# Altium schematic sheet Lighting.SchDoc: Exterior LED Lighting
size A4; DrawnBy: Samyar Sadat Akhavi; Revision: 1.0; SheetNumber: 11; SheetTotal: 13
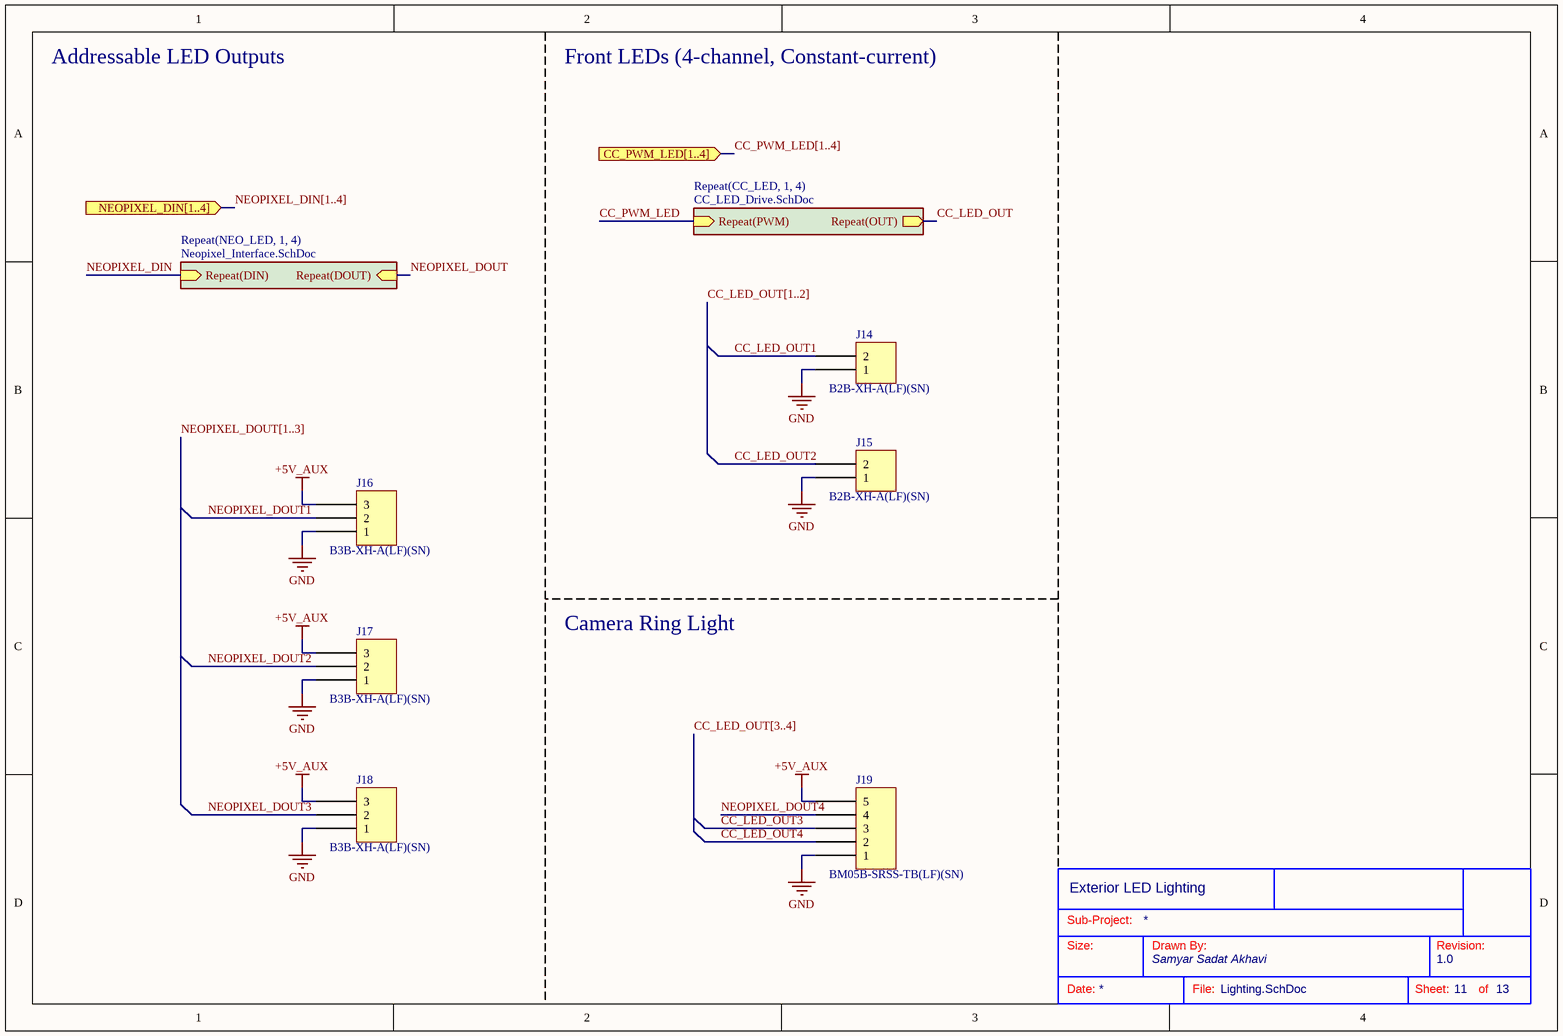
[diagram p0: Lighting.SchDoc]

## Parts
?  (no value)  (graphical)
J14  B2B-XH-A(LF)(SN)  [JST XH B2B-XH-A]
J15  B2B-XH-A(LF)(SN)  [JST XH B2B-XH-A]
J16  B3B-XH-A(LF)(SN)  [JST XH B3B-XH-A]
J17  B3B-XH-A(LF)(SN)  [JST XH B3B-XH-A]
J18  B3B-XH-A(LF)(SN)  [JST XH B3B-XH-A]
J19  BM05B-SRSS-TB(LF)(SN)  [JST BM05B-SRSS-TB]

## Sub-sheets
Repeat(CC_LED, 1, 4) = CC_LED_Drive.SchDoc: Repeat(PWM) (in), Repeat(OUT) (out)
Repeat(NEO_LED, 1, 4) = Neopixel_Interface.SchDoc: Repeat(DIN) (in), Repeat(DOUT) (in)

## Ports
CC_PWM_LED[1..4] (in, see Sensors_IO_Board[3B], Microcontroller[3C]), NEOPIXEL_DIN[1..4] (in, see Sensors_IO_Board[3B])

## Nets
+5V_AUX: J16.3 J17.3 J18.3 J19.5
GND: J14.1 J15.1 J16.1 J17.1 J18.1 J19.1
CC_LED_OUT: sheet Repeat(CC_LED, 1, 4)/Repeat(OUT)
CC_LED_OUT1: J14.2
CC_LED_OUT2: J15.2
CC_LED_OUT3: J19.3
CC_LED_OUT4: J19.2
CC_PWM_LED: sheet Repeat(CC_LED, 1, 4)/Repeat(PWM)
NEOPIXEL_DIN: sheet Repeat(NEO_LED, 1, 4)/Repeat(DIN)
NEOPIXEL_DOUT: sheet Repeat(NEO_LED, 1, 4)/Repeat(DOUT)
NEOPIXEL_DOUT1: J16.2
NEOPIXEL_DOUT2: J17.2
NEOPIXEL_DOUT3: J18.2
NEOPIXEL_DOUT4: J19.4

## Buses and harness runs
bus CC_LED_OUT[1..2]
bus CC_LED_OUT[3..4]
bus CC_PWM_LED[1..4] = port CC_PWM_LED[1..4]
bus NEOPIXEL_DIN[1..4] = port NEOPIXEL_DIN[1..4]
bus NEOPIXEL_DOUT[1..3]

## Notes on the sheet
- Addressable LED Outputs
- Front LEDs (4-channel, Constant-current)
- Camera Ring Light
- Sub-Project:
- Size:
- Drawn By:
- Revision:
- Date:
- File:
- Sheet:
- of

## Library data of the parts
? = Standard Title Block
J14 J15 = B2B-XH-A(LF)(SN): CONN HEADER VERT 2POS 2.5MM; Manufacturer: JST Sales America Inc.; Contact Length - Post: 0.134" (3.40mm); Current Rating (Amps): 3A; Material Flammability Rating: UL94 V-0; Number of Positions: 2; Number of Positions Loaded: All; Pitch - Mating: 0.098" (2.50mm); Shrouding: Shrouded - 4 Wall; Style: Board to Cable/Wire; Voltage Rating: 250V; Part Number: B2B-XH-A(LF)(SN); ComponentLink1Description: Datasheet; ComponentLink1URL: http://www.jst-mfg.com/product/pdf/eng/eXH.pdf; ComponentLink2Description: DigiKey Link; ComponentLink2URL: http://digikey.com/product-detail/en/jst-sales-america-inc/B2B-XH-A-LF-SN/455-2247-ND/1651045; Connector Type: Header; Contact Finish - Mating: Tin; Contact Finish - Post: Tin; Contact Material: Brass; Contact Shape: Square; Contact Type: Male Pin; Fastening Type: Detent Lock; Insulation Color: Natural; Insulation Height: 0.276" (7.00mm); Insulation Material: Polyamide (PA66), Nylon 6/6; LastUpdated: 1/12/2020 11:46:08 PM; Lifecycle Status: Active; Minimum Order: 1; Mounting Type: Through Hole; Number of Rows: 1; Operating Temperature: -25°C ~ 85°C; Packaging: Bulk; PartId: 67; Part Status: Active; Price: 0.15; Series: XH; Supplier 1: DigiKey; Supplier Part Number 1: 455-2247-ND; Termination: Press-Fit, Solder
J16-J18 = B3B-XH-A(LF)(SN): CONN HEADER VERT 3POS 2.5MM; Manufacturer: JST Sales America Inc.; Contact Length - Post: 0.134" (3.40mm); Current Rating (Amps): 3A; Material Flammability Rating: UL94 V-0; Number of Positions: 3; Number of Positions Loaded: All; Pitch - Mating: 0.098" (2.50mm); Shrouding: Shrouded - 4 Wall; Style: Board to Cable/Wire; Voltage Rating: 250V; Part Number: B3B-XH-A(LF)(SN); ComponentLink1Description: Datasheet; ComponentLink1URL: http://www.jst-mfg.com/product/pdf/eng/eXH.pdf; ComponentLink2Description: DigiKey Link; ComponentLink2URL: http://digikey.com/product-detail/en/jst-sales-america-inc/B3B-XH-A-LF-SN/455-2248-ND/1651046; Connector Type: Header; Contact Finish - Mating: Tin; Contact Finish - Post: Tin; Contact Material: Brass; Contact Shape: Square; Contact Type: Male Pin; Fastening Type: Detent Lock; Insulation Color: Natural; Insulation Height: 0.276" (7.00mm); Insulation Material: Polyamide (PA66), Nylon 6/6; LastUpdated: 1/12/2020 11:46:22 PM; Lifecycle Status: Active; Minimum Order: 1; Mounting Type: Through Hole; Number of Rows: 1; Operating Temperature: -25°C ~ 85°C; Packaging: Bulk; PartId: 68; Part Status: Active; Price: 0.19; Series: XH; Supplier 1: DigiKey; Supplier Part Number 1: 455-2248-ND; Termination: Press-Fit, Solder
J19 = BM05B-SRSS-TB(LF)(SN): CONN HEADER SMD 5POS 1MM; Manufacturer: JST Sales America Inc.; Current Rating (Amps): 0.7A; Material Flammability Rating: UL94 V-0; Number of Positions: 5; Number of Positions Loaded: All; Pitch - Mating: 0.039" (1.00mm); Shrouding: Shrouded - 4 Wall; Style: Board to Cable/Wire; Voltage Rating: 50V; Part Number: BM05B-SRSS-TB(LF)(SN); ComponentLink1Description: Datasheet; ComponentLink1URL: http://www.jst-mfg.com/product/pdf/eng/eSR.pdf; ComponentLink2Description: DigiKey Link; ComponentLink2URL: http://digikey.com/product-detail/en/jst-sales-america-inc/BM05B-SRSS-TB-LF-SN/455-1791-1-ND/926862; Connector Type: Header; Contact Finish - Mating: Tin; Contact Finish - Post: Tin; Contact Material: Copper Alloy; Contact Shape: Square; Contact Type: Male Pin; Fastening Type: Push-Pull; Features: Solder Retention; Insulation Color: Natural; Insulation Height: 0.167" (4.25mm); Insulation Material: Polyamide (PA), Nylon; LastUpdated: 1/12/2020 10:14:00 PM; Lifecycle Status: Active; Minimum Order: 1; Mounting Type: Surface Mount; Number of Rows: 1; Operating Temperature: -25°C ~ 85°C; Packaging: TapeAndReel; PartId: 18; Part Status: Active; Price: 0.35; Series: SR; Supplier 1: DigiKey; Supplier Part Number 1: 455-1791-1-ND; Termination: Solder